# EAGLE schematic ScoreBoard-V2 (EAGLE 9.4.2)

## Sheet 1 of 2
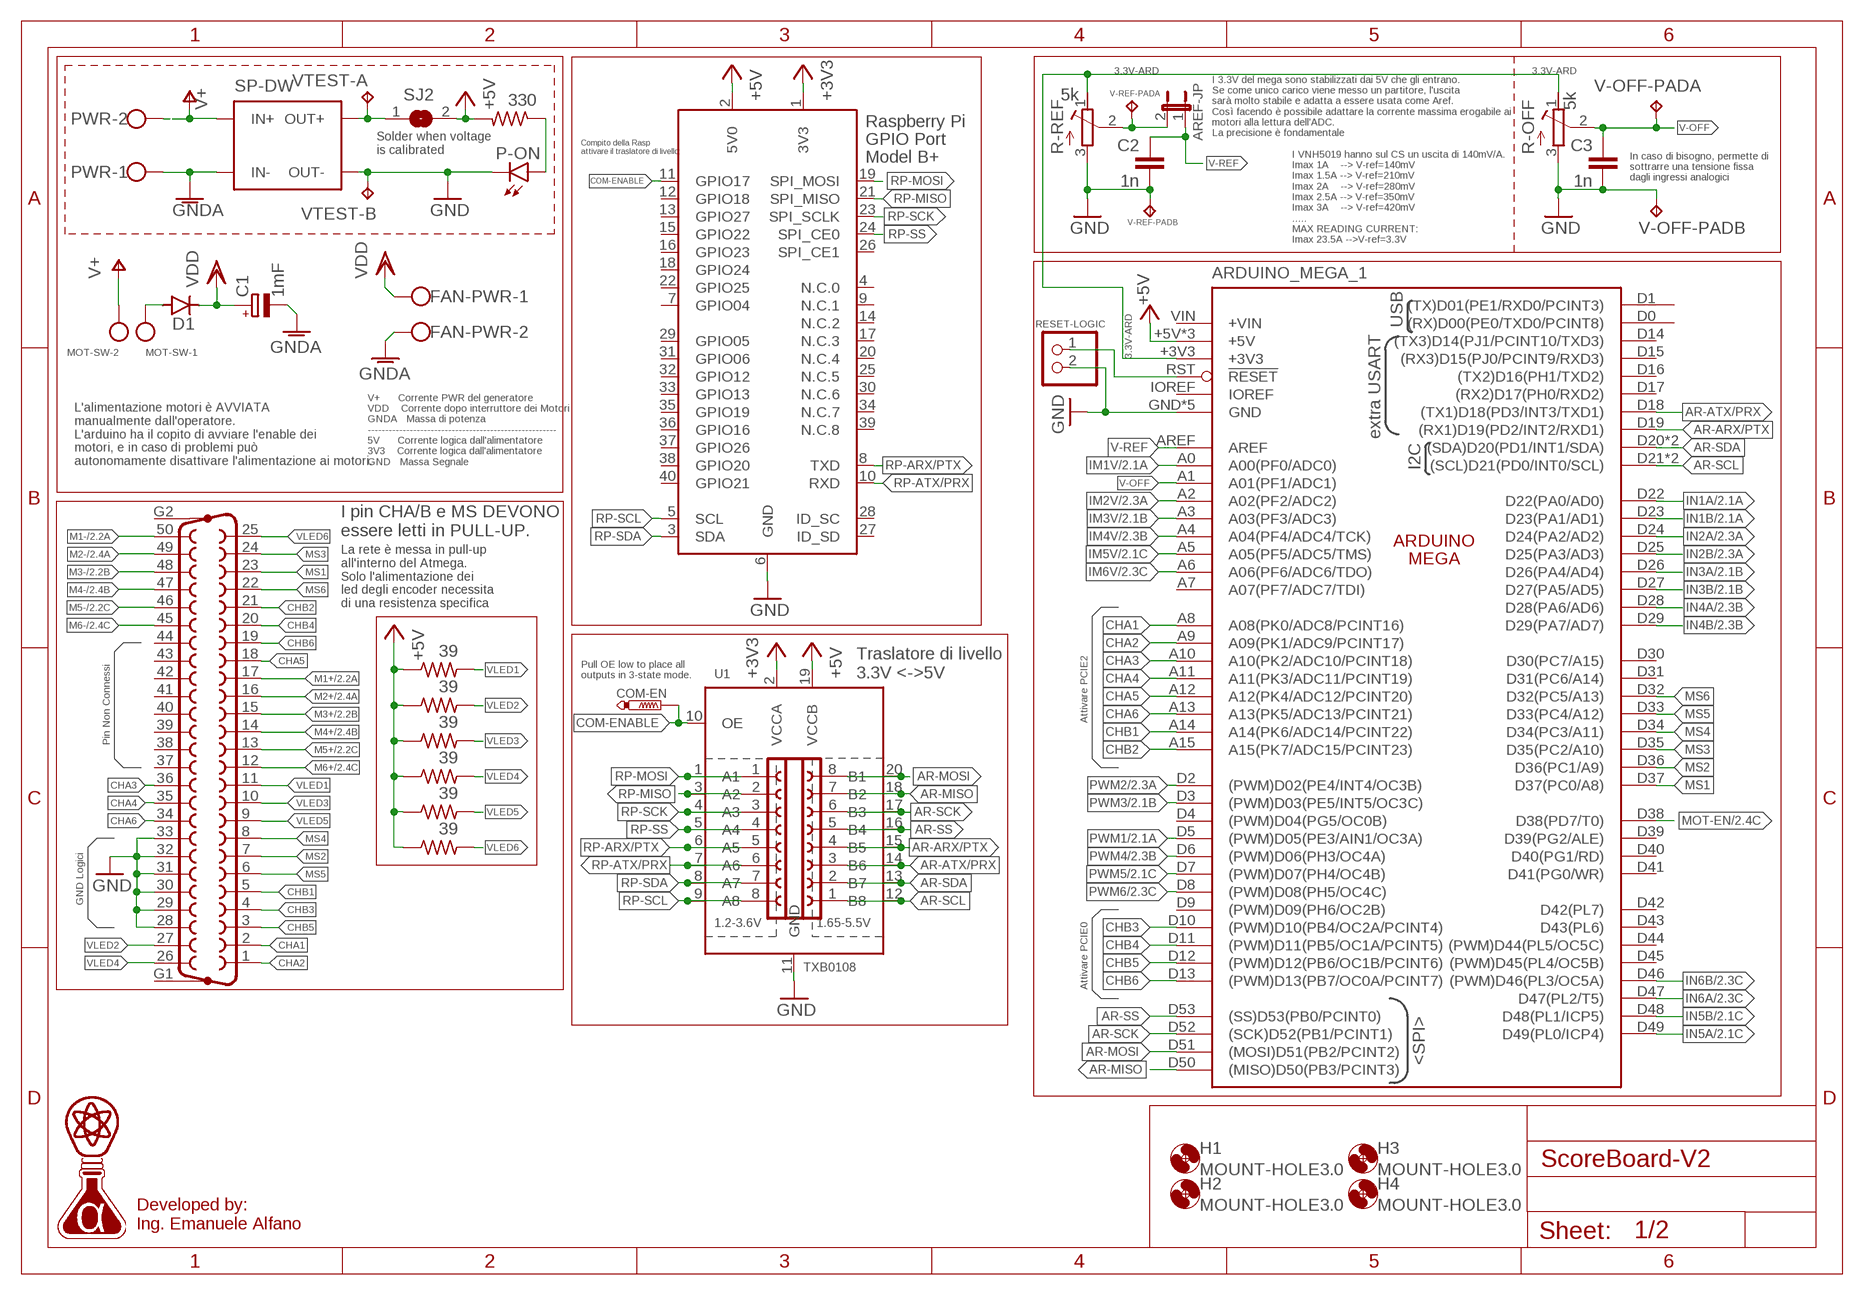
[diagram p0: schematic, sheet 1]

### Parts
ARDUINO_MEGA_1  MEGA_ARDUINONO-HOLE  [MEGA-NO-HOLE]
AREF-JP  JP1E  [JP1]
C1  1mF  CPOL-EUE5-13  [E5-13]
C2  1n  C-EU025-024X044  [C025-024X044]
C3  1n  C-EU025-024X044  [C025-024X044]
COM-EN  PTR1PAD1-13  [P1-13]
D1  ES2D  [SMB]
D-SUB50  F50VP  [F50VP]
FAN-PWR  W237-102  [W237-102]
H1  MOUNT-HOLE3.0  [3,0]
H2  MOUNT-HOLE3.0  [3,0]
H3  MOUNT-HOLE3.0  [3,0]
H4  MOUNT-HOLE3.0  [3,0]
MOT-SW  W237-102  [W237-102]
P-ON  LED3MM  [LED3MM]
PWR  W237-102  [W237-102]
R1  39  R-US_0204/5  [0204/5]
R2  39  R-US_0204/5  [0204/5]
R3  39  R-US_0204/5  [0204/5]
R4  39  R-US_0204/5  [0204/5]
R5  39  R-US_0204/5  [0204/5]
R6  39  R-US_0204/5  [0204/5]
R-OFF  5k  R-TRIMMT93YA  [RTRIMT93YA]
R-REF  5k  R-TRIMMT93YA  [RTRIMT93YA]
RASPBERRY-PY  RASPI_GPIO_B+_BOX  [RASPI_GPIO_B+_BOX]
RESET-LOGIC  PINHD-1X2  [1X02]
RL  330  R-US_0204/7  [0204/7]
SJ2  SJ  [SJ]
SP-DW  DC/DC-STEP-DOWNGLOB  [DC/DC-STEP-DOWN-UNIVERSAL]
SV1  FE08-1  [FE08]
SV2  FE08-1  [FE08]
U1  TXB0108  TXB0108PWR  [TSSOP20]
V-OFF-PAD  TP2P2-38-17  [P2-38-17]
V-REF-PAD  TP2P2-38-17  [P2-38-17]
VTEST-  TP2P2-38-17  [P2-38-17]

### Nets
3.3V-ARD [PLogic]: ARDUINO_MEGA_1.+3V3 R-OFF.1(E) R-REF.1(E)
+3V3: RASPBERRY-PY.1(3V3) U1.2(VCCA)
+5V [PLogic]: ARDUINO_MEGA_1.+5V ARDUINO_MEGA_1.+5V1(+5V) ARDUINO_MEGA_1.+5V2(+5V) R1.1 R2.1 R3.1 R4.1 R5.1 R6.1 RASPBERRY-PY.2(5V0) RL.2 SJ2.2 U1.19(VCCB) ; also sheet 2
AR-ARX/PTX [Logic]: ARDUINO_MEGA_1.D19((RX1)D19(PD2/INT2/RXD1)) SV2.4 U1.15(B5)
AR-ATX/PRX [Logic]: ARDUINO_MEGA_1.D18((TX1)D18(PD3/INT3/TXD1)) SV2.3 U1.14(B6)
AR-MISO [Logic]: ARDUINO_MEGA_1.D50((MISO)D50(PB3/PCINT3)) SV2.7 U1.18(B2)
AR-MOSI [Logic]: ARDUINO_MEGA_1.D51((MOSI)D51(PB2/PCINT2)) SV2.8 U1.20(B1)
AR-SCK [Logic]: ARDUINO_MEGA_1.D52((SCK)D52(PB1/PCINT1)) SV2.6 U1.17(B3)
AR-SCL [Logic]: ARDUINO_MEGA_1.D21((SCL)D21(PD0/INT0/SCL)) ARDUINO_MEGA_1.SCL1((SCL)D21(PD0/INT0/SCL)) SV2.1 U1.12(B8)
AR-SDA [Logic]: ARDUINO_MEGA_1.D20((SDA)D20(PD1/INT1/SDA)) ARDUINO_MEGA_1.SDA1((SDA)D20(PD1/INT1/SDA)) SV2.2 U1.13(B7)
AR-SS [Logic]: ARDUINO_MEGA_1.D53((SS)D53(PB0/PCINT0)) SV2.5 U1.16(B4)
CHA1 [Logic]: ARDUINO_MEGA_1.A8(A08(PK0/ADC8/PCINT16)) D-SUB50.2
CHA2 [Logic]: ARDUINO_MEGA_1.A9(A09(PK1/ADC9/PCINT17)) D-SUB50.1
CHA3 [Logic]: ARDUINO_MEGA_1.A10(A10(PK2/ADC10/PCINT18)) D-SUB50.36
CHA4 [Logic]: ARDUINO_MEGA_1.A11(A11(PK3/ADC11/PCINT19)) D-SUB50.35
CHA5 [Logic]: ARDUINO_MEGA_1.A12(A12(PK4/ADC12/PCINT20)) D-SUB50.18
CHA6 [Logic]: ARDUINO_MEGA_1.A13(A13(PK5/ADC13/PCINT21)) D-SUB50.34
CHB1 [Logic]: ARDUINO_MEGA_1.A14(A14(PK6/ADC14/PCINT22)) D-SUB50.5
CHB2 [Logic]: ARDUINO_MEGA_1.A15(A15(PK7/ADC15/PCINT23)) D-SUB50.21
CHB3 [Logic]: ARDUINO_MEGA_1.D10((PWM)D10(PB4/OC2A/PCINT4)) D-SUB50.4
CHB4 [Logic]: ARDUINO_MEGA_1.D11((PWM)D11(PB5/OC1A/PCINT5)) D-SUB50.20
CHB5 [Logic]: ARDUINO_MEGA_1.D12((PWM)D12(PB6/OC1B/PCINT6)) D-SUB50.3
CHB6 [Logic]: ARDUINO_MEGA_1.D13((PWM)D13(PB7/OC0A/PCINT7)) D-SUB50.19
COM-ENABLE: COM-EN.TP RASPBERRY-PY.11(GPIO17) U1.10(OE)
GND [PLogic]: ARDUINO_MEGA_1.GND ARDUINO_MEGA_1.GND1(GND) ARDUINO_MEGA_1.GND2(GND) ARDUINO_MEGA_1.GND3(GND) ARDUINO_MEGA_1.GND4(GND) C2.2 C3.2 D-SUB50.28 D-SUB50.29 D-SUB50.30 D-SUB50.31 D-SUB50.32 D-SUB50.33 P-ON.K(C) R-OFF.3(A) R-REF.3(A) RASPBERRY-PY.6(GND) RESET-LOGIC.2 SP-DW.OUT- SP-DW.OUT-1(OUT-) SP-DW.OUT-2(OUT-) U1.11(GND) V-OFF-PAD.TP-2 V-REF-PAD.TP-2 VTEST-.TP-2 ; also sheet 2
GNDA [PowerJack]: C1.- FAN-PWR.2 PWR.1 SP-DW.IN- SP-DW.IN-1(IN-) SP-DW.IN-2(IN-) ; also sheet 2
IM1V [Logic]: ARDUINO_MEGA_1.A0(A00(PF0/ADC0)) ; also sheet 2
IM2V [Logic]: ARDUINO_MEGA_1.A2(A02(PF2/ADC2)) ; also sheet 2
IM3V [Logic]: ARDUINO_MEGA_1.A3(A03(PF3/ADC3)) ; also sheet 2
IM4V [Logic]: ARDUINO_MEGA_1.A4(A04(PF4/ADC4/TCK)) ; also sheet 2
IM5V [Logic]: ARDUINO_MEGA_1.A5(A05(PF5/ADC5/TMS)) ; also sheet 2
IM6V [Logic]: ARDUINO_MEGA_1.A6(A06(PF6/ADC6/TDO)) ; also sheet 2
IN1A [Logic]: ARDUINO_MEGA_1.D22(D22(PA0/AD0)) ; also sheet 2
IN1B [Logic]: ARDUINO_MEGA_1.D23(D23(PA1/AD1)) ; also sheet 2
IN2A [Logic]: ARDUINO_MEGA_1.D24(D24(PA2/AD2)) ; also sheet 2
IN2B [Logic]: ARDUINO_MEGA_1.D25(D25(PA3/AD3)) ; also sheet 2
IN3A [Logic]: ARDUINO_MEGA_1.D26(D26(PA4/AD4)) ; also sheet 2
IN3B [Logic]: ARDUINO_MEGA_1.D27(D27(PA5/AD5)) ; also sheet 2
IN4A [Logic]: ARDUINO_MEGA_1.D28(D28(PA6/AD6)) ; also sheet 2
IN4B [Logic]: ARDUINO_MEGA_1.D29(D29(PA7/AD7)) ; also sheet 2
IN5A [Logic]: ARDUINO_MEGA_1.D49(D49(PL0/ICP4)) ; also sheet 2
IN5B [Logic]: ARDUINO_MEGA_1.D48(D48(PL1/ICP5)) ; also sheet 2
IN6A [Logic]: ARDUINO_MEGA_1.D47(D47(PL2/T5)) ; also sheet 2
IN6B [Logic]: ARDUINO_MEGA_1.D46((PWM)D46(PL3/OC5A)) ; also sheet 2
M1+ [PMot]: D-SUB50.17 ; also sheet 2
M1- [PMot]: D-SUB50.50 ; also sheet 2
M2+ [PMot]: D-SUB50.16 ; also sheet 2
M2- [PMot]: D-SUB50.49 ; also sheet 2
M3+ [PMot]: D-SUB50.15 ; also sheet 2
M3- [PMot]: D-SUB50.48 ; also sheet 2
M4+ [PMot]: D-SUB50.14 ; also sheet 2
M4- [PMot]: D-SUB50.47 ; also sheet 2
M5+ [PMot]: D-SUB50.13 ; also sheet 2
M5- [PMot]: D-SUB50.46 ; also sheet 2
M6+ [PMot]: D-SUB50.12 ; also sheet 2
M6- [PMot]: D-SUB50.45 ; also sheet 2
MOT-EN [Logic]: ARDUINO_MEGA_1.D38(D38(PD7/T0)) ; also sheet 2
MS1 [Logic]: ARDUINO_MEGA_1.D37(D37(PC0/A8)) D-SUB50.23
MS2 [Logic]: ARDUINO_MEGA_1.D36(D36(PC1/A9)) D-SUB50.7
MS3 [Logic]: ARDUINO_MEGA_1.D35(D35(PC2/A10)) D-SUB50.24
MS4 [Logic]: ARDUINO_MEGA_1.D34(D34(PC3/A11)) D-SUB50.8
MS5 [Logic]: ARDUINO_MEGA_1.D33(D33(PC4/A12)) D-SUB50.6
MS6 [Logic]: ARDUINO_MEGA_1.D32(D32(PC5/A13)) D-SUB50.22
N$1: P-ON.A RL.1
N$2 [PowerJack]: D1.A MOT-SW.1
N$4 [PLogic]: SJ2.1 SP-DW.OUT+ SP-DW.OUT+1(OUT+) SP-DW.OUT+2(OUT+) VTEST-.TP-1
N$5: ARDUINO_MEGA_1.RST(!RESET) RESET-LOGIC.1
PWM1 [Logic]: ARDUINO_MEGA_1.D5((PWM)D05(PE3/AIN1/OC3A)) ; also sheet 2
PWM2 [Logic]: ARDUINO_MEGA_1.D2((PWM)D02(PE4/INT4/OC3B)) ; also sheet 2
PWM3 [Logic]: ARDUINO_MEGA_1.D3((PWM)D03(PE5/INT5/OC3C)) ; also sheet 2
PWM4 [Logic]: ARDUINO_MEGA_1.D6((PWM)D06(PH3/OC4A)) ; also sheet 2
PWM5 [Logic]: ARDUINO_MEGA_1.D7((PWM)D07(PH4/OC4B)) ; also sheet 2
PWM6 [Logic]: ARDUINO_MEGA_1.D8((PWM)D08(PH5/OC4C)) ; also sheet 2
RP-ARX/PTX: RASPBERRY-PY.8(TXD) SV1.5 U1.6(A5)
RP-ATX/PRX: RASPBERRY-PY.10(RXD) SV1.6 U1.7(A6)
RP-MISO: RASPBERRY-PY.21(SPI_MISO) SV1.2 U1.3(A2)
RP-MOSI: RASPBERRY-PY.19(SPI_MOSI) SV1.1 U1.1(A1)
RP-SCK: RASPBERRY-PY.23(SPI_SCLK) SV1.3 U1.4(A3)
RP-SCL: RASPBERRY-PY.5(SCL) SV1.8 U1.9(A8)
RP-SDA: RASPBERRY-PY.3(SDA) SV1.7 U1.8(A7)
RP-SS: RASPBERRY-PY.24(SPI_CE0) SV1.4 U1.5(A4)
V+ [PowerJack]: MOT-SW.2 PWR.2 SP-DW.IN+ SP-DW.IN+1(IN+) SP-DW.IN+2(IN+)
V-OFF [Logic]: ARDUINO_MEGA_1.A1(A01(PF1/ADC1)) C3.1 R-OFF.2(S) V-OFF-PAD.TP-1
V-REF [Logic]: ARDUINO_MEGA_1.AREF AREF-JP.1 C2.1
V-REF-TRIMM [Logic]: AREF-JP.2 R-REF.2(S) V-REF-PAD.TP-1
VDD [PowerJack]: C1.+ D1.C FAN-PWR.1 ; also sheet 2
VLED1 [PLogic]: D-SUB50.11 R1.2
VLED2 [PLogic]: D-SUB50.27 R2.2
VLED3 [PLogic]: D-SUB50.10 R3.2
VLED4 [PLogic]: D-SUB50.26 R4.2
VLED5 [PLogic]: D-SUB50.9 R5.2
VLED6 [PLogic]: D-SUB50.25 R6.2
Unconnected: ARDUINO_MEGA_1.A7(A07(PF7/ADC7/TDI)) ARDUINO_MEGA_1.D0((RX)D00(PE0/TXD0/PCINT8)) ARDUINO_MEGA_1.D1((TX)D01(PE1/RXD0/PCINT3)) ARDUINO_MEGA_1.D4((PWM)D04(PG5/OC0B)) ARDUINO_MEGA_1.D9((PWM)D09(PH6/OC2B)) ARDUINO_MEGA_1.D14((TX3)D14(PJ1/PCINT10/TXD3)) ARDUINO_MEGA_1.D15((RX3)D15(PJ0/PCINT9/RXD3)) ARDUINO_MEGA_1.D16((TX2)D16(PH1/TXD2)) ARDUINO_MEGA_1.D17((RX2)D17(PH0/RXD2)) ARDUINO_MEGA_1.D30(D30(PC7/A15)) ARDUINO_MEGA_1.D31(D31(PC6/A14)) ARDUINO_MEGA_1.D39(D39(PG2/ALE)) ARDUINO_MEGA_1.D40(D40(PG1/RD)) ARDUINO_MEGA_1.D41(D41(PG0/WR)) ARDUINO_MEGA_1.D42(D42(PL7)) ARDUINO_MEGA_1.D43(D43(PL6)) ARDUINO_MEGA_1.D44((PWM)D44(PL5/OC5C)) ARDUINO_MEGA_1.D45((PWM)D45(PL4/OC5B)) ARDUINO_MEGA_1.IOREF ARDUINO_MEGA_1.VIN(+VIN) D-SUB50.37 D-SUB50.38 D-SUB50.39 D-SUB50.40 D-SUB50.41 D-SUB50.42 D-SUB50.43 D-SUB50.44 D-SUB50.G1 D-SUB50.G2 RASPBERRY-PY.4(N.C.0) RASPBERRY-PY.7(GPIO04) RASPBERRY-PY.9(N.C.1) RASPBERRY-PY.12(GPIO18) RASPBERRY-PY.13(GPIO27) RASPBERRY-PY.14(N.C.2) RASPBERRY-PY.15(GPIO22) RASPBERRY-PY.16(GPIO23) RASPBERRY-PY.17(N.C.3) RASPBERRY-PY.18(GPIO24) RASPBERRY-PY.20(N.C.4) RASPBERRY-PY.22(GPIO25) RASPBERRY-PY.25(N.C.5) RASPBERRY-PY.26(SPI_CE1) RASPBERRY-PY.27(ID_SD) RASPBERRY-PY.28(ID_SC) RASPBERRY-PY.29(GPIO05) RASPBERRY-PY.30(N.C.6) RASPBERRY-PY.31(GPIO06) RASPBERRY-PY.32(GPIO12) RASPBERRY-PY.33(GPIO13) RASPBERRY-PY.34(N.C.7) RASPBERRY-PY.35(GPIO19) RASPBERRY-PY.36(GPIO16) RASPBERRY-PY.37(GPIO26) RASPBERRY-PY.38(GPIO20) RASPBERRY-PY.39(N.C.8) RASPBERRY-PY.40(GPIO21)

### Notes on the sheet
- I 3.3V del mega sono stabilizzati dai 5V che gli entrano.
  Se come unico carico viene messo un partitore, l'uscita 
  sarà molto stabile e adatta a essere usata come Aref.
  Così facendo è possibile adattare la corrente massima erogabile ai
  motori alla lettura dell'ADC.
  La precisione è fondamentale
- Solder when voltage
  is calibrated
- Compito della Rasp 
  attivare il traslatore di livello
- In caso di bisogno, permette di
  sottrarre una tensione fissa
  dagli ingressi analogici
- I VNH5019 hanno sul CS un uscita di 140mV/A.
  Imax 1A    --> V-ref=140mV
  Imax 1.5A --> V-ref=210mV
  Imax 2A    --> V-ref=280mV
  Imax 2.5A --> V-ref=350mV
  Imax 3A    --> V-ref=420mV
  .....
  MAX READING CURRENT:
  Imax 23.5A -->V-ref=3.3V
- L'alimentazione motori è AVVIATA
  manualmente dall'operatore.
  L'arduino ha il copito di avviare l'enable dei
  motori, e in caso di problemi può
  autonomamente disattivare l'alimentazione ai motori.
- V+      Corrente PWR del generatore
  VDD    Corrente dopo interruttore dei Motori
  GNDA   Massa di potenza
  ------------------------------------------------------
  5V      Corrente logica dall'alimentatore
  3V3    Corrente logica dall'alimentatore
  GND   Massa Segnale
- I pin CHA/B e MS DEVONO
  essere letti in PULL-UP.
- La rete è messa in pull-up
  all'interno del Atmega.
  Solo l'alimentazione dei
  led degli encoder necessita
  di una resistenza specifica
- Pull OE low to place all
  outputs in 3-state mode.
- Traslatore di livello
  3.3V <->5V
- Attivare PCIE2
- Pin Non Connessi
- GND Logici
- Attivare PCIE0
- Developed by:
  Ing. Emanuele Alfano

## Sheet 2 of 2
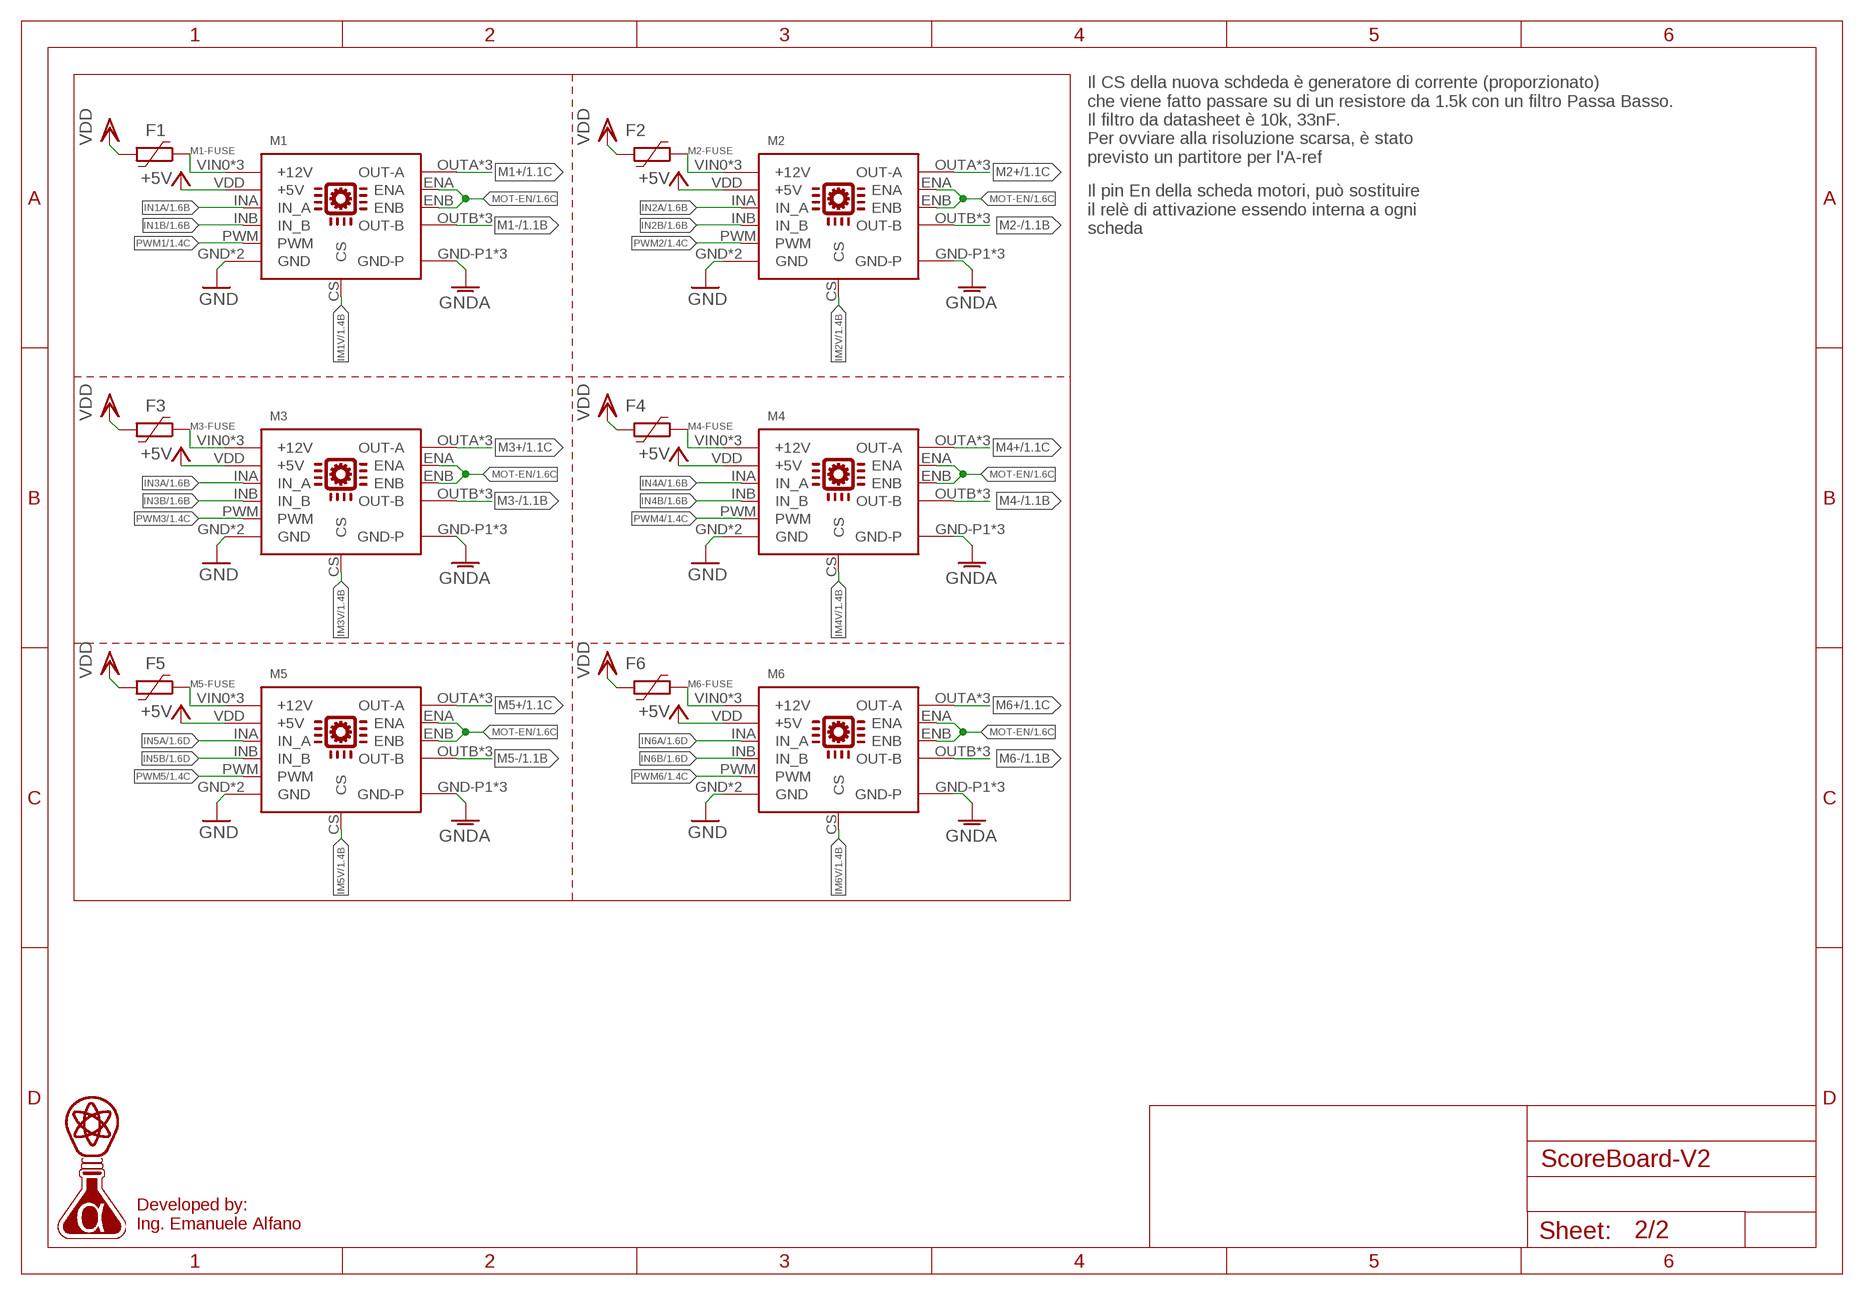
[diagram p1: schematic, sheet 2]

### Parts
F1  2410-BOX  [BELFUSE0679-3000-12]
F2  2410-BOX  [BELFUSE0679-3000-12]
F3  2410-BOX  [BELFUSE0679-3000-12]
F4  2410-BOX  [BELFUSE0679-3000-12]
F5  2410-BOX  [BELFUSE0679-3000-12]
F6  2410-BOX  [BELFUSE0679-3000-12]
M1  VNH5019  [VNH5019]
M2  VNH5019  [VNH5019]
M3  VNH5019  [VNH5019]
M4  VNH5019  [VNH5019]
M5  VNH5019  [VNH5019]
M6  VNH5019  [VNH5019]

### Nets
+5V [PLogic]: M1.VDD(+5V) M2.VDD(+5V) M3.VDD(+5V) M4.VDD(+5V) M5.VDD(+5V) M6.VDD(+5V) ; also sheet 1
GND [PLogic]: M1.GND M1.GND1(GND) M2.GND M2.GND1(GND) M3.GND M3.GND1(GND) M4.GND M4.GND1(GND) M5.GND M5.GND1(GND) M6.GND M6.GND1(GND) ; also sheet 1
GNDA [PowerJack]: M1.GND-P1(GND-P) M1.GND-P2(GND-P) M1.GND-P3(GND-P) M2.GND-P1(GND-P) M2.GND-P2(GND-P) M2.GND-P3(GND-P) M3.GND-P1(GND-P) M3.GND-P2(GND-P) M3.GND-P3(GND-P) M4.GND-P1(GND-P) M4.GND-P2(GND-P) M4.GND-P3(GND-P) M5.GND-P1(GND-P) M5.GND-P2(GND-P) M5.GND-P3(GND-P) M6.GND-P1(GND-P) M6.GND-P2(GND-P) M6.GND-P3(GND-P) ; also sheet 1
IM1V [Logic]: M1.CS ; also sheet 1
IM2V [Logic]: M2.CS ; also sheet 1
IM3V [Logic]: M3.CS ; also sheet 1
IM4V [Logic]: M4.CS ; also sheet 1
IM5V [Logic]: M5.CS ; also sheet 1
IM6V [Logic]: M6.CS ; also sheet 1
IN1A [Logic]: M1.INA(IN_A) ; also sheet 1
IN1B [Logic]: M1.INB(IN_B) ; also sheet 1
IN2A [Logic]: M2.INA(IN_A) ; also sheet 1
IN2B [Logic]: M2.INB(IN_B) ; also sheet 1
IN3A [Logic]: M3.INA(IN_A) ; also sheet 1
IN3B [Logic]: M3.INB(IN_B) ; also sheet 1
IN4A [Logic]: M4.INA(IN_A) ; also sheet 1
IN4B [Logic]: M4.INB(IN_B) ; also sheet 1
IN5A [Logic]: M5.INA(IN_A) ; also sheet 1
IN5B [Logic]: M5.INB(IN_B) ; also sheet 1
IN6A [Logic]: M6.INA(IN_A) ; also sheet 1
IN6B [Logic]: M6.INB(IN_B) ; also sheet 1
M1+ [PMot]: M1.OUTA2(OUT-A) M1.OUTA3(OUT-A) M1.OUTA(OUT-A) ; also sheet 1
M1- [PMot]: M1.OUTB1(OUT-B) M1.OUTB3(OUT-B) M1.OUTB(OUT-B) ; also sheet 1
M1-FUSE [PowerJack]: F1.1 M1.VIN0(+12V) M1.VIN1(+12V) M1.VIN2(+12V)
M2+ [PMot]: M2.OUTA2(OUT-A) M2.OUTA3(OUT-A) M2.OUTA(OUT-A) ; also sheet 1
M2- [PMot]: M2.OUTB1(OUT-B) M2.OUTB3(OUT-B) M2.OUTB(OUT-B) ; also sheet 1
M2-FUSE [PowerJack]: F2.1 M2.VIN0(+12V) M2.VIN1(+12V) M2.VIN2(+12V)
M3+ [PMot]: M3.OUTA2(OUT-A) M3.OUTA3(OUT-A) M3.OUTA(OUT-A) ; also sheet 1
M3- [PMot]: M3.OUTB1(OUT-B) M3.OUTB3(OUT-B) M3.OUTB(OUT-B) ; also sheet 1
M3-FUSE [PowerJack]: F3.1 M3.VIN0(+12V) M3.VIN1(+12V) M3.VIN2(+12V)
M4+ [PMot]: M4.OUTA2(OUT-A) M4.OUTA3(OUT-A) M4.OUTA(OUT-A) ; also sheet 1
M4- [PMot]: M4.OUTB1(OUT-B) M4.OUTB3(OUT-B) M4.OUTB(OUT-B) ; also sheet 1
M4-FUSE [PowerJack]: F4.1 M4.VIN0(+12V) M4.VIN1(+12V) M4.VIN2(+12V)
M5+ [PMot]: M5.OUTA2(OUT-A) M5.OUTA3(OUT-A) M5.OUTA(OUT-A) ; also sheet 1
M5- [PMot]: M5.OUTB1(OUT-B) M5.OUTB3(OUT-B) M5.OUTB(OUT-B) ; also sheet 1
M5-FUSE [PowerJack]: F5.1 M5.VIN0(+12V) M5.VIN1(+12V) M5.VIN2(+12V)
M6+ [PMot]: M6.OUTA2(OUT-A) M6.OUTA3(OUT-A) M6.OUTA(OUT-A) ; also sheet 1
M6- [PMot]: M6.OUTB1(OUT-B) M6.OUTB3(OUT-B) M6.OUTB(OUT-B) ; also sheet 1
M6-FUSE [PowerJack]: F6.1 M6.VIN0(+12V) M6.VIN1(+12V) M6.VIN2(+12V)
MOT-EN [Logic]: M1.ENA M1.ENB M2.ENA M2.ENB M3.ENA M3.ENB M4.ENA M4.ENB M5.ENA M5.ENB M6.ENA M6.ENB ; also sheet 1
PWM1 [Logic]: M1.PWM ; also sheet 1
PWM2 [Logic]: M2.PWM ; also sheet 1
PWM3 [Logic]: M3.PWM ; also sheet 1
PWM4 [Logic]: M4.PWM ; also sheet 1
PWM5 [Logic]: M5.PWM ; also sheet 1
PWM6 [Logic]: M6.PWM ; also sheet 1
VDD [PowerJack]: F1.2 F2.2 F3.2 F4.2 F5.2 F6.2 ; also sheet 1

### Notes on the sheet
- Il CS della nuova schdeda è generatore di corrente (proporzionato)
  che viene fatto passare su di un resistore da 1.5k con un filtro Passa Basso.
  Il filtro da datasheet è 10k, 33nF.
  Per ovviare alla risoluzione scarsa, è stato
  previsto un partitore per l'A-ref
- Il pin En della scheda motori, può sostituire
  il relè di attivazione essendo interna a ogni
  scheda
- Developed by:
  Ing. Emanuele Alfano

## Library data of the parts
ARDUINO_MEGA_1 = ARDUINO_DODO:MEGA_ARDUINO
AREF-JP = jumper:JP1E: JUMPER
C1 = rcl:CPOL-EU: POLARIZED CAPACITOR, European symbol; SPICEPREFIX: C
C2 C3 = rcl:C-EU: CAPACITOR, European symbol; SPICEPREFIX: C
COM-EN = testpad:PTR1: TEST PIN
D1 = diode:ES2D: DIODE super fast rectifier, 2 A
D-SUB50 = con-subd:F50VP: SUB-D; OC_FARNELL: unknown; OC_NEWARK: unknown
F1-F6 = polyfuse-smd_10:?: Polyfuse Resettable PTC Source: http://www.littelfuse.com/products/resettable-ptcs.aspx
FAN-PWR MOT-SW PWR = con-wago-500:W237-102: WAGO SCREW CLAMP; MPN: 237-102; OC_FARNELL: unknown; OC_NEWARK: 70K9898
H1-H4 = holes:MOUNT-HOLE: MOUNTING HOLE with drill center marker
M1-M6 = DRIVER POLOLU:VNH5019: aggiornato il 24/10/14 con pin cs (AD)
P-ON = led:LED: LED OSRAM: - CHIPLED LG R971, LG N971, LY N971, LG Q971, LY Q971, LO R971, LY R971 LH N974, LH R974 LS Q976, LO Q976, LY Q976 LO Q996 - Hyper CHIPLED LW Q18S LB Q993, LB Q99A, LB R99A - SideLED LS A670, LO A670, LY A670, LG A670, LP A670 LB A673, LV A673, LT A673, LW A673 LH A674 LY A675 LS A676, LA A676, LO A676, LY A676, LW A676 LS A679, LY A679, LG A679 - Hyper Micro SIDELED® LS Y876, LA Y876, LO Y876, LY Y876 LT Y87S - SmartLED LW L88C, LW L88S LB L89C, LB L89S, LG L890 LS L89K, LO L89K, LY L89K LS L896, LA L896, LO L896, LY L896 - TOPLED LS T670, LO T670, LY T670, LG T670, LP T670 LSG T670, LSP T670, LSY T670, LOP T670, LYG T670 LG T671, LOG T671, LSG T671 LB T673, LV T673, LT T673, LW T673 LH T674 LS T676, LA T676, LO T676, LY T676, LB T676, LH T676, LSB T676, LW T676 LB T67C, LV T67C, LT T67C, LS T67K, LO T67K, LY T67K, LW E67C LS E67B, LA E67B, LO E67B, LY E67B, LB E67C, LV E67C, LT E67C LW T67C LS T679, LY T679, LG T679 LS T770, LO T770, LY T770, LG T770, LP T770 LB T773, LV T773, LT T773, LW T773 LH T774 LS E675, LA E675, LY E675, LS T675 LS T776, LA T776, LO T776, LY T776, LB T776 LHGB T686 LT T68C, LB T68C - Hyper Mini TOPLED® LB M676 - Mini TOPLED Santana® LG M470 LS M47K, LO M47K, LY M47K Source: http://www.osram.convergy.de LUXEON: - LUMILED® LXK2-PW12-R00, LXK2-PW12-S00, LXK2-PW14-U00, LXK2-PW14-V00 LXK2-PM12-R00, LXK2-PM12-S00, LXK2-PM14-U00 LXK2-PE12-Q00, LXK2-PE12-R00, LXK2-PE12-S00, LXK2-PE14-T00, LXK2-PE14-U00 LXK2-PB12-K00, LXK2-PB12-L00, LXK2-PB12-M00, LXK2-PB14-N00, LXK2-PB14-P00, LXK2-PB14-Q00 LXK2-PR12-L00, LXK2-PR12-M00, LXK2-PR14-Q00, LXK2-PR14-R00 LXK2-PD12-Q00, LXK2-PD12-R00, LXK2-PD12-S00 LXK2-PH12-R00, LXK2-PH12-S00 LXK2-PL12-P00, LXK2-PL12-Q00, LXK2-PL12-R00 Source: www.luxeon.com KINGBRIGHT: KA-3528ASYC Source: www.kingbright.com
R1-R6 RL = rcl:R-US_: RESISTOR, American symbol; SPICEPREFIX: R
R-OFF R-REF = rcl:R-TRIMM: Trimm resistor; SPICEMODEL: X; SPICEPREFIXL: POT
RASPBERRY-PY = raspberrypi_bastelstube_v13:RASPI_GPIO_B+: Only the 2x20 header connector, nothing else
RESET-LOGIC = pinhead:PINHD-1X2: PIN HEADER
SJ2 = jumper:SJ: SMD solder JUMPER; SPICEPREFIX: B
SP-DW = diy-modules:DC/DC-STEP-DOWN: Step-down DC/DC basato su mp1584
SV1 SV2 = con-lsta:FE08-1: FEMALE HEADER; OC_FARNELL: unknown; OC_NEWARK: unknown
U1 = TXB0108PWR:TXB0108PWR: 8-Bit Bi-Directional Level Shifter 1.2V-3.6V (VCCA) to 1.65V-5.5V (VCCB) bi-directional level shifter with auto direction sensing. Max data rate - VCCA 1.8V: 20Mbps (50ns), VCCA 3.3V: 100Mbps (10ns) Digikey: 296-21527-1-ND; AVAILABILITY: Unavailable; DESCRIPTION: 8-Bit Bidirectional Voltage-Level Translator with Auto Direction Sensing and +/-15-kV ESD Protect 20-TSSOP -40 to 85; MF: Texas Instruments; MP: TXB0108PWR; PACKAGE: TSSOP-20 Texas Instruments; PRICE: None
V-OFF-PAD V-REF-PAD VTEST- = testpad:TP2: Test pad; SPICEPREFIX: X

## Net classes
1 PowerJack: width 1.778 mm, drill 1.016 mm, clearance 0.254 mm
2 PMot: width 0.635 mm, drill 0.508 mm, clearance 0.203 mm
3 PLogic: width 0.203 mm, drill 0.406 mm, clearance 0.152 mm
4 Logic: width 0.152 mm